# EasyEDA Pro project ProDocument_CPUCable_2023-08-07.epro

# Schematic Schematic4
Create Date: 2023-04-15; Page Name: P1; Project Name: FS2040_NSPW_FN13101; Schematic Name: Schematic4; Update Date: 2023-04-15; Company: 嘉立创EDA; Page Size: A3; Version: V1.0
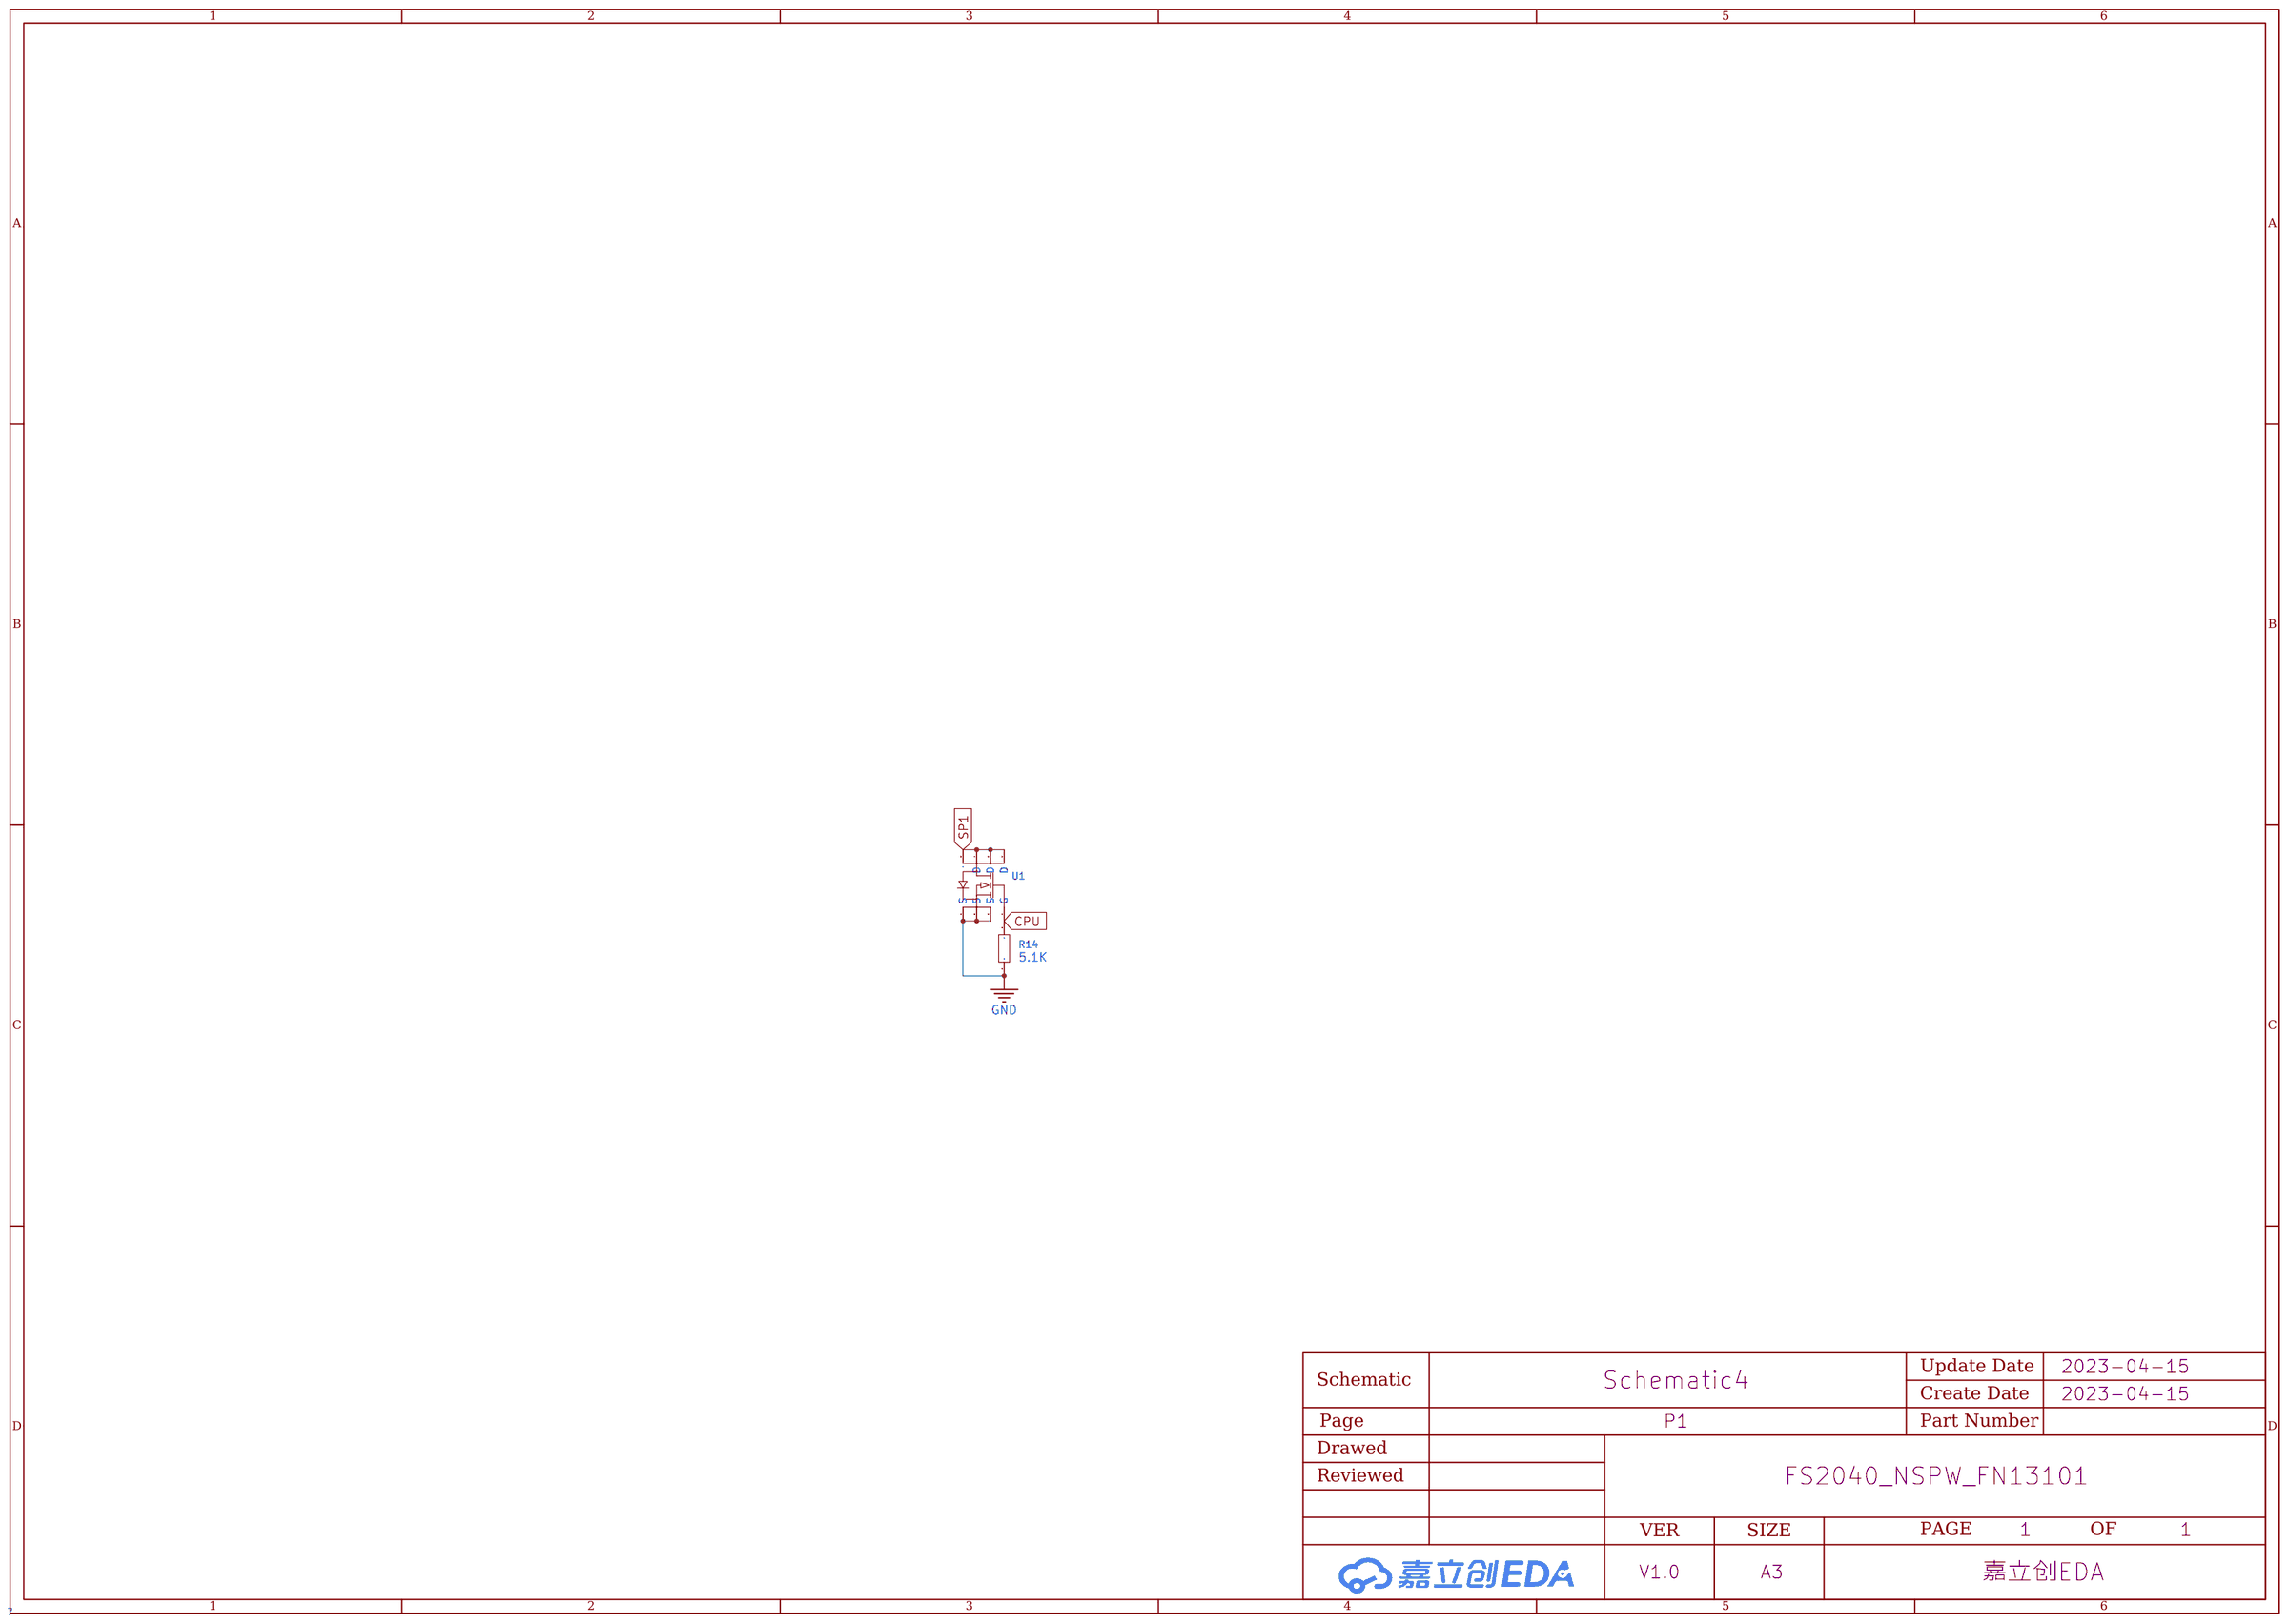
[diagram p0: schematic sheet]

## Parts
R14  5.1K  [R0402_FS]
U1  AP50N03DF  [POWERVDFN-8_L3.2-W3.1-P0.65-LS3.3-BL-1]

## Library data of the parts
R14 = RMC04025.1K1%N: 阻值:5.1kΩ;精度:±1%;功率:62.5mW;; LCSC Part Name: 5.1kΩ ±1% 62.5mW; Supplier Part: C325521; Manufacturer: Tyohm(幸亚电阻); Supplier Footprint: 0402; JLCPCB Part Class: Extended Part; Datasheet: https://atta.szlcsc.com/upload/public/pdf/source/20190115/C325521_1EC5F156994D781C7E2B08432302F19F.pdf; Supplier: LCSC; Tolerance: ±1%; Power(Watts): 62.5mW
U1 = AP50N03DF: 类型:N沟道;漏源电压(Vdss):30V;连续漏极电流(Id):50A;功率(Pd):26W;导通电阻(RDS(on)@Vgs,Id):10.5mΩ@10V,6A;阈值电压(Vgs(th)@Id):1.6V@250uA;栅极电荷(Qg@Vgs):4.2nC@4.5V;输入电容(Ciss@Vds):870pF@15V;反向传输电容(Crss@Vds):87pF@15V;工作温度:-55℃~+150℃@(Tj);; LCSC Part Name: N沟道 30V 50A; Supplier Part: C3011272; Manufacturer: APM(永源微电子); Supplier Footprint: PDFN-8L(3x3); JLCPCB Part Class: Extended Part; Datasheet: https://atta.szlcsc.com/upload/public/pdf/source/20220513/E6E6E07767A418CFE2CF54FF8E524C5B.pdf; Supplier: LCSC; Type: N沟道; Drain Source Voltage (Vdss): 30V; Continuous Drain Current (Id): 50A; Power Dissipation (Pd): 26W; Drain Source On Resistance (RDS(on)@Vgs,Id): 10.5mΩ@10V,6A; Gate Threshold Voltage (Vgs(th)@Id): 1.6V@250uA; Total Gate Charge (Qg@Vgs): 4.2nC@4.5V; Input Capacitance (Ciss@Vds): 870pF@15V; Reverse Transfer Capacitance (Crss@Vds): 87pF@15V; Operating Temperature: -55℃~+150℃@(Tj)

## Nets
GND: R14.1 U1.1(S) U1.2(S) U1.3(S)
CPU: R14.2 U1.4(G)
SP1: U1.5(D) U1.6(D) U1.7(D) U1.8(D)

# Board PCB6_2
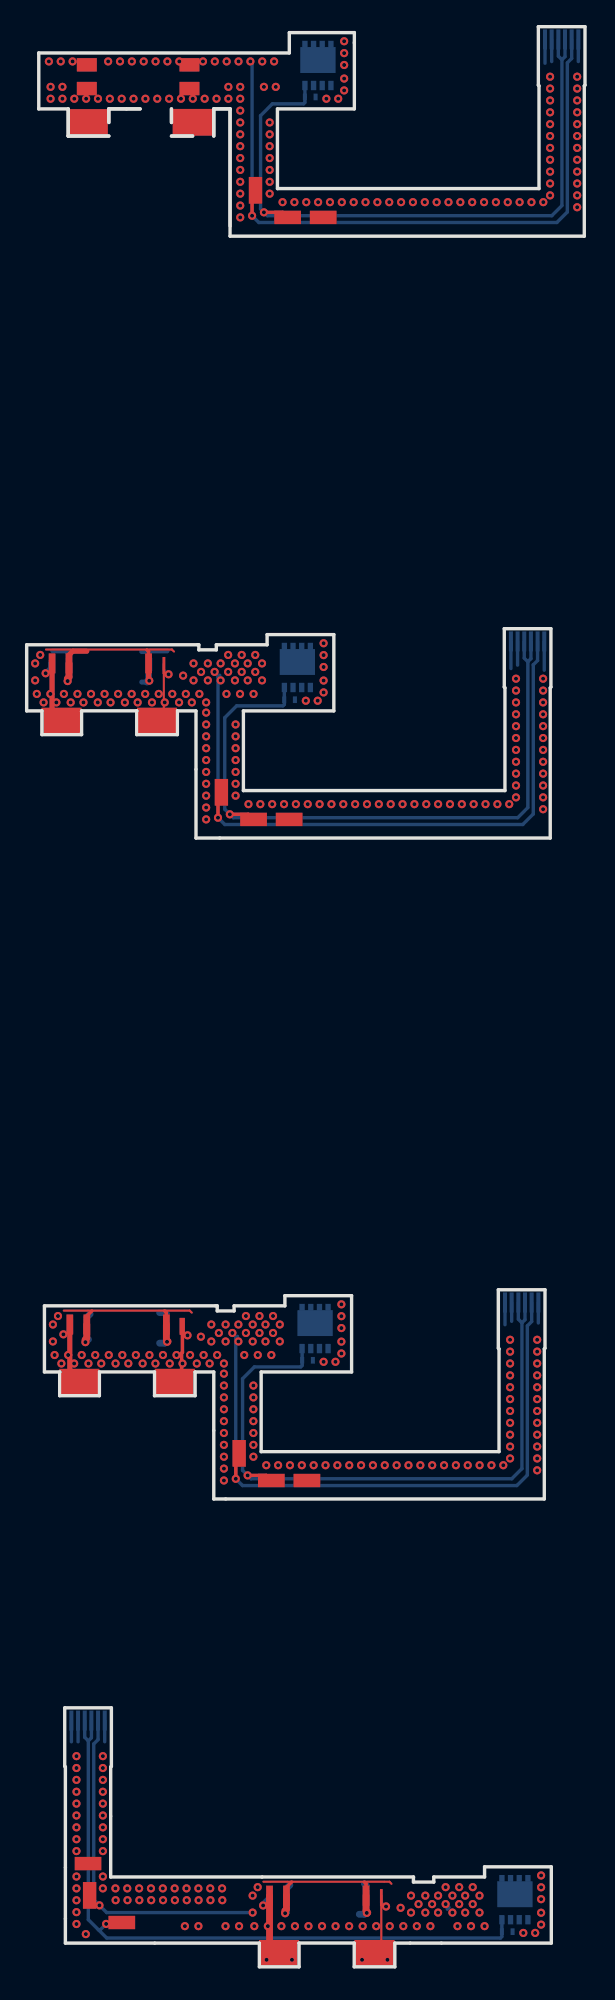
[diagram p1: board, top side]
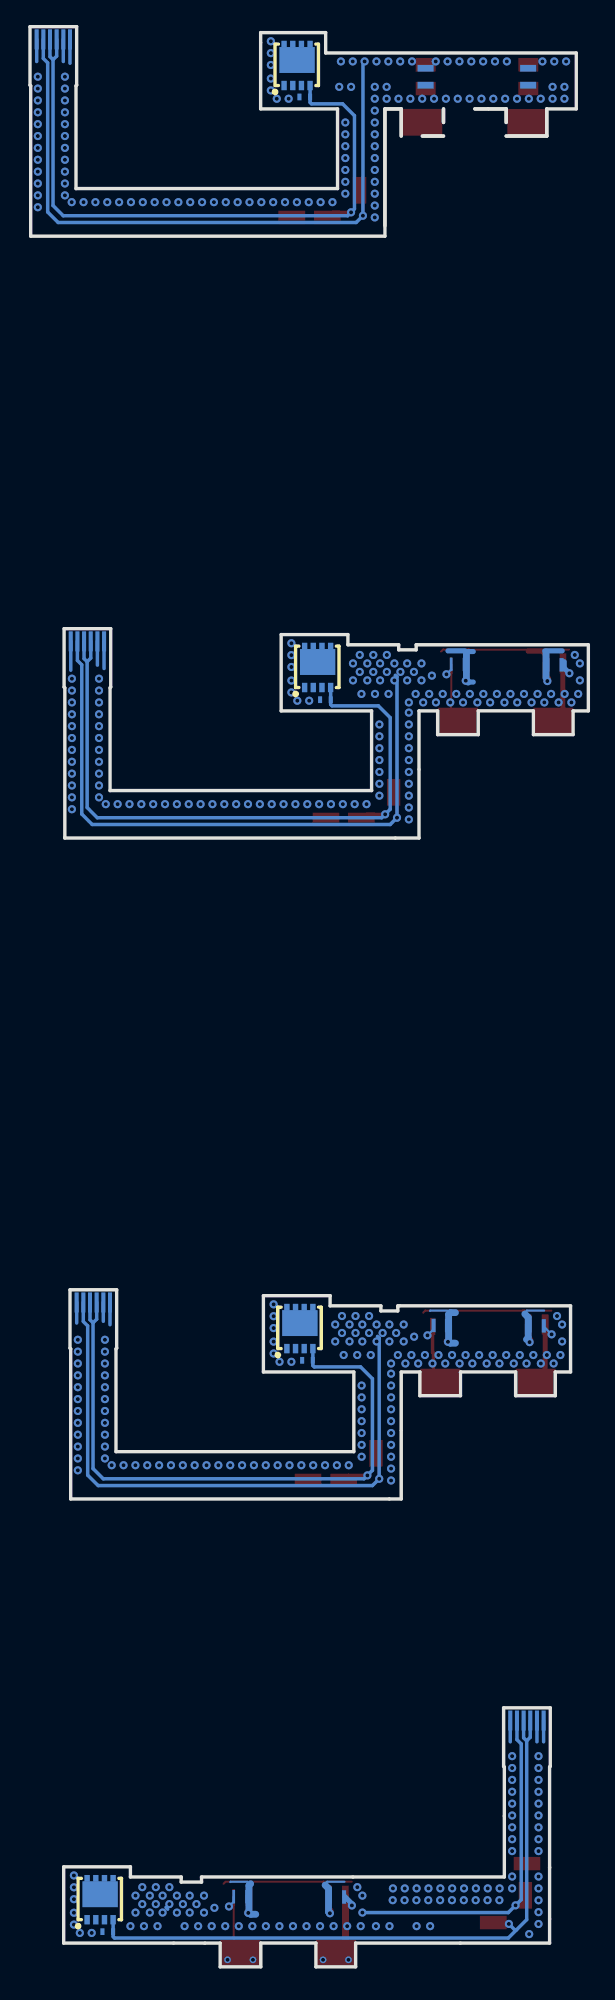
[diagram p2: board, bottom side, seen from below]

Outline 41.88 x 145.32 mm; copper layers: Top Layer, Bottom Layer. Coordinates in mm from the lower left corner of the outline.
Outline path: 3.11,139.17 0.91,139.17 0.91,143.36 19.7,143.36 19.7,144.88 24.58,144.88 24.58,139.17 18.81,139.17 18.81,133.2 38.43,133.2 38.43,140.9 38.38,140.95 38.38,145.32 41.88,145.32 41.88,140.95 41.82,140.89 41.82,129.63 15.26,129.63 15.26,139.17 ; 3.11,139.17 3.11,137.13 ; 3.11,139.17 3.11,137.13 ; 3.11,137.13 6.16,137.13 3.11,137.13 ; 6.16,139.17 6.16,138.15 6.16,139.17 ; 6.16,139.17 8.51,139.17 6.16,139.17 ; 14.04,139.17 14.04,137.13 14.04,139.17 ; 14.04,139.17 15.26,139.17 ; 14.04,139.17 15.26,139.17 ; 15.26,139.17 15.26,130.4 ; 0,99.03 0,94.08 1.14,94.08 1.14,92.3 4.12,92.3 4.12,94.08 8.25,94.08 8.25,92.3 11.3,92.3 11.3,94.08 12.7,94.08 12.7,84.55 39.27,84.55 39.27,95.8 39.32,95.85 39.32,100.23 35.82,100.23 35.82,95.86 35.87,95.81 35.87,88.11 16.26,88.11 16.26,94.08 23.04,94.08 23.04,99.79 18.03,99.79 18.03,99.03 14.22,99.03 14.22,98.65 12.91,98.65 12.91,99.03 0,99.03 ; 1.33,49.51 1.33,44.56 2.48,44.56 2.48,42.78 5.45,42.78 5.45,44.56 9.59,44.56 9.59,42.78 12.64,42.78 12.64,44.56 14.03,44.56 14.03,35.05 38.82,35.05 38.82,46.28 38.88,46.34 38.88,50.72 35.38,50.72 35.38,46.34 35.43,46.29 35.43,38.59 17.59,38.59 17.59,44.56 24.37,44.56 24.37,50.27 19.37,50.27 19.37,49.51 15.56,49.51 15.56,49.13 14.29,49.13 14.29,49.51 1.33,49.51 ; 2.85,19.4 6.35,19.4 6.35,15.02 6.3,14.97 6.3,6.73 29.01,6.73 29.01,6.35 30.54,6.35 30.54,6.73 34.35,6.73 34.35,7.49 39.35,7.49 39.35,1.78 27.62,1.78 27.62,0 24.57,0 24.57,1.78 20.43,1.78 20.43,0 17.46,0 17.46,1.78 2.91,1.78 2.91,14.97 2.85,15.02 2.85,19.4 ; 10.86,139.17 10.86,138.15 10.86,139.17 ; 10.86,137.13 12.45,137.13 10.86,137.13
Stack: Top Layer 0.035mm / Dielectric1 0.025mm PI er 3.3 / Bottom Layer 0.035mm

## Design rules (mm)
template: 用户自定义配置
spacing safeClearance (default): track to track 0.152, other pairs 0 to 0.152
track width trackWidth (default): min 0.127, default 0.254, max 2.54
differential pair differentialPair (default): width min 0.127, default 0.254, max 2.54; gap min 0.152, default 0.152
via viaSize (default): diameter min 0.5, default 0.61, max 10; hole min 0.3, default 0.305, max 5.999

## Placement (name value [footprint] x y rotation side)
NOREF  -  [Pad_e165]  41.38 144.37 0 top
NOREF#2  -  [Pad_e341]  22.24 131.04 90 top
NOREF#3  -  [Pad_e644]  4.51 140.69 0 top
NOREF#4  -  [Pad_e157]  39.88 144.37 0 top
NOREF#5  -  [Pad_e158]  40.38 144.37 0 top
NOREF#6  -  [Pad_e96]  2.62 93.31 0 top
NOREF#7  -  [Pad_e247]  25.46 5.33 90 top
NOREF#8  -  [Pad_e3117]  4.41 48.01 270 top
NOREF#9  -  [Pad_e598]  12.21 142.47 0 top
NOREF#10  -  [Pad_e167]  40.88 144.37 0 top
NOREF#11  -  [Pad_e2862]  36.38 49.76 0 top
NOREF#12  -  [Pad_e3034]  11.11 43.8 0 top
NOREF#13  -  [Pad_e297]  26.09 1.02 0 top
NOREF#14  -  [Pad_e97]  10.3 97.48 90 top
NOREF#15  -  [Pad_e92]  2.01 97.53 270 top
NOREF#16  -  [Pad_e1716]  37.82 99.28 0 top
NOREF#17  -  [Pad_e3133]  11.61 48.04 90 top
NOREF#18  -  [Pad_e272]  18.22 5.33 270 top
NOREF#19  -  [Pad_e489]  7.13 3.32 90 top
NOREF#20  -  [Pad_e592]  4.51 142.21 0 top
NOREF#21  -  [Pad_e2852]  37.38 49.76 0 top
NOREF#22  -  [Pad_e1673]  37.32 99.28 0 top
NOREF#23  -  [Pad_e3112]  10.6 48.04 90 top
NOREF#24  -  [Pad_e150]  38.88 144.37 0 top
NOREF#25  -  [Pad_e492]  4.6 7.73 90 top
NOREF#26  -  [Pad_e95]  9.78 93.31 0 top
NOREF#27  -  [Pad_e1717]  38.32 99.28 0 top
NOREF#28  -  [Pad_e270]  26.6 5.19 90 top
NOREF#29  -  [Pad_e148]  4.35 18.45 0 top
NOREF#30  -  [Pad_e2851]  35.88 49.76 0 top
NOREF#31  -  [Pad_e271]  18.32 5.23 270 top
NOREF#32  -  [Pad_e646]  12.21 140.94 0 top
NOREF#33  -  [Pad_e3121]  10.48 48.11 90 top
NOREF#34  -  [Pad_e280]  25.58 5.26 90 top
NOREF#35  -  [Pad_e93]  9.27 97.56 90 top
NOREF#36  -  [Pad_e2858]  37.88 49.76 0 top
NOREF#37  -  [Pad_e273]  19.39 5.23 270 top
NOREF#38  -  [Pad_e1764]  17.02 85.95 90 top
NOREF#39  -  [Pad_e94]  10.29 97.56 90 top
NOREF#40  -  [Pad_e340]  19.57 131.04 90 top
NOREF#41  -  [Pad_e91]  3.07 97.53 270 top
NOREF#42  -  [Pad_e102]  3.18 97.63 270 top
NOREF#43  -  [Pad_e398]  5.35 18.45 0 top
NOREF#44  -  [Pad_e396]  5.85 18.45 0 top
NOREF#45  -  [Pad_e395]  4.85 18.45 0 top
NOREF#46  -  [Pad_e1675]  36.82 99.28 0 top
NOREF#47  -  [Pad_e593]  12.21 142.21 0 top
NOREF#48  -  [Pad_e490]  4.72 5.35 0 top
NOREF#49  -  [Pad_e1707]  14.6 87.98 0 top
NOREF#50  -  [Pad_e3119]  3.24 48.11 270 top
NOREF#51  -  [Pad_e3037]  21.02 36.43 90 top
NOREF#52  -  [Pad_e2861]  36.88 49.76 0 top
NOREF#53  -  [Pad_e276]  19.49 5.33 270 top
NOREF#54  -  [Pad_e1763]  19.69 85.95 90 top
NOREF#55  -  [Pad_e2995]  3.95 43.8 0 top
NOREF#56  -  [Pad_e1719]  38.82 99.28 0 top
NOREF#57  -  [Pad_e278]  26.6 5.26 90 top
NOREF#58  -  [Pad_e3129]  11.67 47.97 90 top
NOREF#59  -  [Pad_e1718]  36.32 99.28 0 top
NOREF#60  -  [Pad_e399]  3.35 18.45 0 top
NOREF#61  -  [Pad_e2849]  38.38 49.76 0 top
NOREF#62  -  [Pad_e2986]  15.94 38.46 0 top
NOREF#63  -  [Pad_e557]  17.16 133.07 0 top
NOREF#64  -  [Pad_e645]  12.21 140.69 0 top
NOREF#65  -  [Pad_e3120]  4.51 48.11 270 top
NOREF#66  -  [Pad_e151]  39.38 144.37 0 top
NOREF#67  -  [Pad_e98]  9.14 97.63 90 top
NOREF#68  -  [Pad_e668]  4.59 138.15 0 top
NOREF#69  -  [Pad_e647]  4.51 140.94 0 top
NOREF#70  -  [Pad_e3063]  18.35 36.43 90 top
NOREF#71  -  [Pad_e238]  18.93 1.02 0 top
NOREF#72  -  [Pad_e3118]  3.34 48.01 270 top
NOREF#73  -  [Pad_e101]  1.91 97.63 270 top
NOREF#74  -  [Pad_e595]  4.51 142.47 0 top
NOREF#75  -  [Pad_e400]  3.85 18.45 0 top
NOREF#76  -  [Pad_e667]  12.45 138.17 0 top
R14  5.1K  [R0402_FS]  19.72 94.91 180 bottom
R14#2  -  [R0402_FS]  21.07 45.43 180 bottom
R14#3  -  [R0402_FS]  21.27 140.06 180 bottom
R14#4  -  [R0402_FS]  36.04 2.64 180 bottom
U1  AP50N03DF  [POWERVDFN-8_L3.2-W3.1-P0.65-LS3.3-BL-1]  20.3 97.38 180 bottom
U1#2  -  [POWERVDFN-8_L3.2-W3.1-P0.65-LS3.3-BL-1]  21.64 47.86 180 bottom
U1#3  -  [POWERVDFN-8_L3.2-W3.1-P0.65-LS3.3-BL-1]  21.84 142.47 180 bottom
U1#4  -  [POWERVDFN-8_L3.2-W3.1-P0.65-LS3.3-BL-1]  36.62 5.08 180 bottom

## Footprints (pads in the part's own frame, mm; a bottom-side part is the same pattern mirrored in y, then rotated)
Pad_e91
  rect 1x0.3 smd far side: 1(0,0)
Pad_e92
  rect 1x0.3 smd far side: 1(0,0)
Pad_e93
  rect 1x0.3 smd far side: 1(0,0)
Pad_e94
  rect 1x0.2 smd far side: 1(0,0)
Pad_e95
  rect 3x2 smd: 1(0,0)
Pad_e96
  rect 3x2 smd: 1(0,0)
Pad_e97
  rect 1.27x0.2 smd: 1(0,0)
Pad_e98
  rect 1.5x0.5 smd: 1(0,0)
Pad_e101
  rect 1.5x0.5 smd: 1(0,0)
Pad_e102
  rect 1.5x0.5 smd: 1(0,0)
Pad_e148
  rect 0.3x1.5 smd far side: 1(0,0)
Pad_e150
  rect 0.3x1.5 smd far side: 1(0,0)
Pad_e151
  rect 0.3x1.5 smd far side: 1(0,0)
Pad_e157
  rect 0.3x1.5 smd far side: 1(0,0)
Pad_e158
  rect 0.3x1.5 smd far side: 1(0,0)
Pad_e165
  rect 0.3x1.5 smd far side: 1(0,0)
Pad_e167
  rect 0.3x1.5 smd far side: 1(0,0)
Pad_e238
  rect 3x2 smd: 1(0,0)
Pad_e247
  rect 1.5x0.5 smd: 1(0,0)
Pad_e270
  rect 1.27x0.2 smd: 1(0,0)
Pad_e271
  rect 1x0.3 smd far side: 1(0,0)
Pad_e272
  rect 1.5x0.5 smd: 1(0,0)
Pad_e273
  rect 1x0.3 smd far side: 1(0,0)
Pad_e276
  rect 1.5x0.5 smd: 1(0,0)
Pad_e278
  rect 1x0.2 smd far side: 1(0,0)
Pad_e280
  rect 1x0.3 smd far side: 1(0,0)
Pad_e297
  rect 3x2 smd: 1(0,0)
Pad_e340
  rect 1x2 smd: 1(0,0)
Pad_e341
  rect 1x2 smd: 1(0,0)
Pad_e395
  rect 0.3x1.5 smd far side: 1(0,0)
Pad_e396
  rect 0.3x1.5 smd far side: 1(0,0)
Pad_e398
  rect 0.3x1.5 smd far side: 1(0,0)
Pad_e399
  rect 0.3x1.5 smd far side: 1(0,0)
Pad_e400
  rect 0.3x1.5 smd far side: 1(0,0)
Pad_e489
  rect 1x2 smd: 1(0,0)
Pad_e490
  rect 1x2 smd: 1(0,0)
Pad_e492
  rect 1x2 smd: 1(0,0)
Pad_e557
  rect 1x2 smd: 1(0,0)
Pad_e592
  rect 1.2x0.5 smd far side: 1(0,0)
Pad_e593
  rect 1.2x0.5 smd far side: 1(0,0)
Pad_e595
  rect 1.5x1 smd: 1(0,0)
Pad_e598
  rect 1.5x1 smd: 1(0,0)
Pad_e644
  rect 1.5x1 smd: 1(0,0)
Pad_e645
  rect 1.5x1 smd: 1(0,0)
Pad_e646
  rect 1.2x0.5 smd far side: 1(0,0)
Pad_e647
  rect 1.2x0.5 smd far side: 1(0,0)
Pad_e667
  rect 3x2 smd: 1(0,0)
Pad_e668
  rect 3x2 smd: 1(0,0)
Pad_e1673
  rect 0.3x1.5 smd far side: 1(0,0)
Pad_e1675
  rect 0.3x1.5 smd far side: 1(0,0)
Pad_e1707
  rect 1x2 smd: 1(0,0)
Pad_e1716
  rect 0.3x1.5 smd far side: 1(0,0)
Pad_e1717
  rect 0.3x1.5 smd far side: 1(0,0)
Pad_e1718
  rect 0.3x1.5 smd far side: 1(0,0)
Pad_e1719
  rect 0.3x1.5 smd far side: 1(0,0)
Pad_e1763
  rect 1x2 smd: 1(0,0)
Pad_e1764
  rect 1x2 smd: 1(0,0)
Pad_e2849
  rect 0.3x1.5 smd far side: 1(0,0)
Pad_e2851
  rect 0.3x1.5 smd far side: 1(0,0)
Pad_e2852
  rect 0.3x1.5 smd far side: 1(0,0)
Pad_e2858
  rect 0.3x1.5 smd far side: 1(0,0)
Pad_e2861
  rect 0.3x1.5 smd far side: 1(0,0)
Pad_e2862
  rect 0.3x1.5 smd far side: 1(0,0)
Pad_e2986
  rect 1x2 smd: 1(0,0)
Pad_e2995
  rect 3x2 smd: 1(0,0)
Pad_e3034
  rect 3x2 smd: 1(0,0)
Pad_e3037
  rect 1x2 smd: 1(0,0)
Pad_e3063
  rect 1x2 smd: 1(0,0)
Pad_e3112
  rect 1x0.3 smd far side: 1(0,0)
Pad_e3117
  rect 1x0.3 smd far side: 1(0,0)
Pad_e3118
  rect 1x0.3 smd far side: 1(0,0)
Pad_e3119
  rect 1.5x0.5 smd: 1(0,0)
Pad_e3120
  rect 1.5x0.5 smd: 1(0,0)
Pad_e3121
  rect 1.5x0.5 smd: 1(0,0)
Pad_e3129
  rect 1.27x0.4 smd: 1(0,0)
Pad_e3133
  rect 1x0.3 smd far side: 1(0,0)
POWERVDFN-8_L3.2-W3.1-P0.65-LS3.3-BL-1
  rect 0.4x0.7 smd: 1(-0.975,-1.55) 2(-0.325,-1.55) 3(0.325,-1.55) 4(0.975,-1.55)
  rect 0.4x0.5 smd: 5(0.975,1.55) 6(0.325,1.55) 7(-0.325,1.55) 8(-0.975,1.55)
  rect 2.65x1.94 smd: 8(0,0.36)
R0402_FS
  rect 0.3x0.5 smd: 1(-0.4,0) 2(0.4,0)

## Nets
GND: NOREF.1 NOREF#2.1 NOREF#3.1 NOREF#6.1 NOREF#11.1 NOREF#12.1 NOREF#13.1 NOREF#14.1 NOREF#15.1 NOREF#17.1 NOREF#18.1 NOREF#24.1 NOREF#25.1 NOREF#26.1 NOREF#28.1 NOREF#30.1 NOREF#31.1 NOREF#32.1 NOREF#39.1 NOREF#44.1 NOREF#46.1 NOREF#50.1 NOREF#51.1 NOREF#54.1 NOREF#55.1 NOREF#56.1 NOREF#57.1 NOREF#58.1 NOREF#59.1 NOREF#60.1 NOREF#61.1 NOREF#64.1 NOREF#66.1 NOREF#68.1 NOREF#69.1 NOREF#71.1 NOREF#72.1 NOREF#73.1 NOREF#75.1 NOREF#76.1 R14.1 R14#2.1 R14#3.1 R14#4.1 U1.1 U1.2 U1.3 U1#2.1 U1#2.2 U1#2.3 U1#3.1 U1#3.2 U1#3.3 U1#4.1 U1#4.2 U1#4.3
CPU: NOREF#4.1 NOREF#5.1 NOREF#16.1 NOREF#19.1 NOREF#21.1 NOREF#22.1 NOREF#29.1 NOREF#38.1 NOREF#40.1 NOREF#45.1 NOREF#52.1 NOREF#70.1 R14.2 R14#2.2 R14#3.2 R14#4.2 U1.4 U1#2.4 U1#3.4 U1#4.4
SP1: NOREF#7.1 NOREF#8.1 NOREF#9.1 NOREF#10.1 NOREF#20.1 NOREF#23.1 NOREF#27.1 NOREF#33.1 NOREF#34.1 NOREF#35.1 NOREF#36.1 NOREF#37.1 NOREF#41.1 NOREF#42.1 NOREF#43.1 NOREF#47.1 NOREF#48.1 NOREF#49.1 NOREF#53.1 NOREF#62.1 NOREF#63.1 NOREF#65.1 NOREF#67.1 NOREF#74.1 U1.5 U1.6 U1.7 U1.8 U1#2.5 U1#2.6 U1#2.7 U1#2.8 U1#3.5 U1#3.6 U1#3.7 U1#3.8 U1#4.5 U1#4.6 U1#4.7 U1#4.8

## Via types
v1: diameter 0.61, hole 0.305, Top Layer to Bottom Layer, 472 vias
v2: diameter 0.5, hole 0.299, Top Layer to Bottom Layer, 4 vias

## Routing (per net, layer and track width the routed paths; a pad name or vN(x,y) marks a point on that pad's centre or on a via; arc(x,y) is an arc through that point)
GND: length 53.3
  Top Layer w0.152: 10.29,97.63 10.29,93.82 NOREF#26.1 ; 26.6,5.33 26.6,1.52 NOREF#13.1
  Top Layer w0.254: 11.68,48.12 11.68,46.03 11.62,45.97 11.62,44.3 NOREF#12.1
  Top Layer w0.381: NOREF#73.1 1.91,94.02 NOREF#6.1 ; NOREF#55.1 3.24,44.51 NOREF#50.1
  Top Layer w0.508: NOREF#71.1 18.22,1.73 NOREF#18.1
  Bottom Layer w0.152: v1(26.96,4.52) 26.6,4.88 NOREF#57.1 ; v1(12.06,47.3) 11.62,47.75 11.62,48.04 ; v1(2.76,47.38) 3.34,47.96 NOREF#72.1 ; NOREF#39.1 10.29,97.17 v1(10.64,96.82)
  Bottom Layer w0.254: NOREF#75.1 3.85,16.86 ; NOREF#24.1 38.88,142.59 ; NOREF#66.1 39.38,142.72 ; NOREF#44.1 5.85,16.86 ; NOREF.1 41.38,142.72 ; NOREF#61.1 38.38,48.23 ; NOREF#56.1 38.82,97.12 ; NOREF#60.1 3.35,16.86 ; NOREF#46.1 36.82,97.5 ; NOREF#59.1 36.32,97.25 ; NOREF#11.1 36.38,48.36 ; NOREF#30.1 35.88,48.1
  Bottom Layer w0.381: v1(17.73,4.6) 17.73,4.72 18.24,5.23 ; 1.81,97.76 1.81,97.29 v1(1.42,96.89)
  vias: v1(0.76,95.35) v1(1.27,94.71) v1(1.79,140.82) v1(1.79,139.93) v1(1.78,95.35) v1(2.1,45.83) v1(2.23,94.71) v1(2.6,45.19) v1(2.68,140.82) v1(2.68,139.93) v1(2.79,95.35) v1(3.11,45.83) v1(3.3,94.71) v1(3.57,139.93) v1(3.56,45.19) v1(3.81,95.35) v1(3.74,15.78) v1(3.74,14.89) v1(3.74,14) v1(3.74,13.11) v1(3.74,12.23) v1(3.74,11.34) v1(3.74,10.45) v1(3.74,9.56) v1(3.74,8.67) v1(3.74,6.76) v1(3.74,5.88) v1(3.74,4.99) v1(3.74,4.1) v1(3.74,3.21) v1(4.13,45.83) v1(4.26,94.71) v1(4.46,139.93) v1(4.44,2.45) v1(4.64,45.19) v1(4.83,95.35) v1(5.14,45.83) v1(5.35,139.93) v1(5.33,94.71) v1(5.59,45.19) v1(5.72,15.78) v1(5.72,14.89) v1(5.72,14) v1(5.72,13.11) v1(5.72,12.23) v1(5.72,11.34) v1(5.72,10.45) v1(5.72,9.56) v1(5.72,8.67) v1(5.72,6.76) v1(5.72,5.88) v1(5.84,95.35) v1(6.16,45.83) v1(6.24,139.93) v1(6.29,94.71) v1(6.67,45.19) v1(6.66,5.88) v1(6.67,4.99) v1(6.86,95.35) v1(7.13,139.93) v1(7.18,45.83) v1(7.37,94.71) v1(7.55,5.88) v1(7.56,4.99) v1(7.63,45.19) v1(7.87,95.35) v1(8.02,139.93) v1(8.19,45.83) v1(8.32,94.71) v1(8.43,5.88) v1(8.45,4.99) v1(8.7,45.19) v1(8.91,139.93) v1(8.89,95.35) v1(9.21,45.83) v1(9.4,94.71) v1(9.32,5.88) v1(9.34,4.99) v1(9.66,45.19) v1(9.79,139.93) v1(9.91,95.35) v1(10.21,5.88) v1(10.22,45.83) v1(10.23,4.99) v1(10.36,94.71) v1(10.68,139.93) v1(10.73,45.19) v1(10.92,95.35) v1(11.1,5.88) v1(11.12,4.99) v1(11.24,45.83) v1(11.43,94.71) v1(11.57,139.93) v1(11.69,45.19) v1(11.87,3.05) v1(11.94,95.35) v1(11.99,5.88) v1(12.01,4.99) v1(12.26,45.83) v1(12.39,94.71) v1(12.46,139.93) v1(12.76,45.19) v1(12.88,5.88) v1(12.9,4.99) v1(12.88,3.05) v1(12.95,95.35) v1(13.27,45.83) v1(13.35,139.93) v1(13.46,94.71) v1(13.46,93.95) v1(13.46,93.06) v1(13.46,92.17) v1(13.46,91.28) v1(13.46,90.39) v1(13.46,89.5) v1(13.46,88.61) v1(13.46,87.73) v1(13.46,86.84) v1(13.46,85.95) v1(13.72,45.19) v1(13.77,5.88) v1(13.78,4.99) v1(14.24,139.93) v1(14.29,45.83) v1(14.66,5.88) v1(14.67,4.99) v1(14.8,45.19) v1(14.8,44.43) v1(14.8,43.54) v1(14.8,42.65) v1(14.8,41.76) v1(14.8,40.87) v1(14.8,39.99) v1(14.8,39.1) v1(14.8,38.21) v1(14.8,37.32) v1(14.8,36.43) v1(14.91,3.05) v1(14.99,95.35) v1(15.13,140.82) v1(15.13,139.93) v1(15.67,93.06) v1(15.67,92.17) v1(15.67,91.28) v1(15.67,90.39) v1(15.67,89.5) v1(15.67,88.61) v1(15.67,87.73) v1(16.02,140.82) v1(16.02,139.93) v1(16.02,139.04) v1(16.02,138.15) v1(16.02,137.26) v1(16.02,136.37) v1(16.02,135.48) v1(16.02,134.59) v1(16.02,133.71) v1(16.02,132.82) v1(16.02,131.93) v1(16.02,131.04) v1(16,95.35) v1(15.93,3.05) v1(16.32,45.83) v1(16.64,87.09) v1(17.02,95.35) v1(17.01,43.54) v1(17.01,42.65) v1(17.01,41.76) v1(17.01,40.87) v1(17.01,39.99) v1(17.01,39.1) v1(17.01,38.21) v1(17.07,3.05) v1(17.34,45.83) v1(17.53,87.09) v1(17.8,140.82) v1(17.97,37.57) v1(18.09,3.05) v1(18.23,138.15) v1(18.23,137.26) v1(18.23,136.37) v1(18.23,135.48) v1(18.23,134.59) v1(18.23,133.71) v1(18.23,132.82) v1(18.41,87.09) v1(18.35,45.83) v1(18.69,140.82) v1(18.86,37.57) v1(19.11,3.05) v1(19.19,132.18) v1(19.3,87.09) v1(19.75,37.57) v1(20.08,132.18) v1(20.19,87.09) v1(20.12,3.05) v1(20.64,37.57) v1(20.97,132.18) v1(20.94,94.84) v1(21.08,87.09) v1(21.14,3.05) v1(21.53,37.57) v1(21.86,132.18) v1(21.83,94.84) v1(21.97,87.09) v1(22.15,3.05) v1(22.27,99.14) v1(22.27,98.25) v1(22.27,97.36) v1(22.27,96.35) v1(22.27,95.46) v1(22.27,45.32) v1(22.42,37.57) v1(22.48,139.93) v1(22.75,132.18) v1(22.86,87.09) v1(23.16,45.32) v1(23.17,3.05) v1(23.3,37.57) v1(23.37,139.93) v1(23.61,49.62) v1(23.61,48.74) v1(23.61,47.85) v1(23.61,46.83) v1(23.61,45.94) v1(23.64,132.18) v1(23.81,144.23) v1(23.81,143.34) v1(23.81,142.46) v1(23.81,141.44) v1(23.81,140.55) v1(23.75,87.09) v1(24.19,37.57) v1(24.19,3.05) v1(24.53,132.18) v1(24.64,87.09) v1(25.08,37.57) v1(25.2,3.05) v1(25.42,132.18) v1(25.53,87.09) v1(25.97,37.57) v1(26.22,3.05) v1(26.31,132.18) v1(26.42,87.09) v1(26.86,37.57) v1(27.19,132.18) v1(27.31,87.09) v1(27.23,3.05) v1(27.75,37.57) v1(28.08,132.18) v1(28.19,87.09) v1(28.25,3.05) v1(28.64,37.57) v1(28.97,132.18) v1(29.08,87.09) v1(29.27,3.05) v1(29.53,37.57) v1(29.86,132.18) v1(29.97,87.09) v1(30.28,3.05) v1(30.42,37.57) v1(30.75,132.18) v1(30.86,87.09) v1(31.31,37.57) v1(31.64,132.18) v1(31.75,87.09) v1(32.19,37.57) v1(32.31,3.05) v1(32.53,132.18) v1(32.64,87.09) v1(33.08,37.57) v1(33.42,132.18) v1(33.33,3.05) v1(33.53,87.09) v1(33.97,37.57) v1(34.31,132.18) v1(34.42,87.09) v1(34.35,3.05) v1(34.86,37.57) v1(35.19,132.18) v1(35.31,87.09) v1(35.75,37.57) v1(36.08,132.18) v1(36.19,87.09) v1(36.26,46.97) v1(36.26,46.08) v1(36.26,45.19) v1(36.26,44.3) v1(36.26,43.41) v1(36.26,42.53) v1(36.26,41.64) v1(36.26,40.75) v1(36.26,39.86) v1(36.26,38.97) v1(36.26,38.08) v1(36.7,96.49) v1(36.7,95.6) v1(36.7,94.71) v1(36.7,93.82) v1(36.7,92.93) v1(36.7,92.04) v1(36.7,91.15) v1(36.7,90.27) v1(36.7,89.38) v1(36.7,88.49) v1(36.7,87.6) v1(36.97,132.18) v1(37.25,2.54) v1(37.86,132.18) v1(38.14,2.54) v1(38.29,46.97) v1(38.29,46.08) v1(38.29,45.19) v1(38.29,44.3) v1(38.29,43.41) v1(38.29,42.53) v1(38.29,41.64) v1(38.29,40.75) v1(38.29,39.86) v1(38.29,38.97) v1(38.29,38.08) v1(38.29,37.19) v1(38.59,6.85) v1(38.59,5.96) v1(38.59,5.07) v1(38.59,4.05) v1(38.59,3.16) v1(38.75,132.18) v1(38.73,96.49) v1(38.73,95.6) v1(38.73,94.71) v1(38.73,93.82) v1(38.73,92.93) v1(38.73,92.04) v1(38.73,91.15) v1(38.73,90.27) v1(38.73,89.38) v1(38.73,88.49) v1(38.73,87.6) v1(38.73,86.71) v1(39.26,141.58) v1(39.26,140.69) v1(39.26,139.8) v1(39.26,138.91) v1(39.26,138.02) v1(39.26,137.13) v1(39.26,136.25) v1(39.26,135.36) v1(39.26,134.47) v1(39.26,133.58) v1(39.26,132.69) v1(41.29,141.58) v1(41.29,140.69) v1(41.29,139.8) v1(41.29,138.91) v1(41.29,138.02) v1(41.29,137.13) v1(41.29,136.25) v1(41.29,135.36) v1(41.29,134.47) v1(41.29,133.58) v1(41.29,132.69) v1(41.29,131.8) v2(17.99,0.53) v2(19.9,0.53) v2(25.16,0.53) v2(27.06,0.53)
CPU: length 204.6
  Top Layer w0.254: NOREF#70.1 17.97,36.81 v1(16.57,36.81) ; NOREF#38.1 16.64,86.33 v1(15.24,86.33) ; v1(17.8,131.42) 19.19,131.42 NOREF#40.1
  Bottom Layer w0.254: 37.59,97.76 37.32,98.03 NOREF#22.1 ; 37.59,97.76 37.82,97.99 NOREF#16.1 ; 37.59,97.76 37.59,86.84 36.83,86.07 15.49,86.07 v1(15.24,86.33) 14.86,86.71 14.86,93.57 15.75,94.46 19.22,94.46 19.33,94.56 U1.4 ; 4.62,16.92 4.62,3.54 5.39,2.77 ; 4.62,16.92 4.35,17.19 NOREF#29.1 ; 4.62,16.92 4.85,17.15 NOREF#45.1 ; U1#4.4 35.64,2.26 35.54,2.16 6,2.16 5.39,2.77 ; 37.15,48.24 37.15,37.32 36.39,36.56 16.83,36.56 v1(16.57,36.81) 16.19,37.19 16.19,44.05 17.08,44.94 20.56,44.94 20.66,45.04 U1#2.4 ; 37.15,48.24 37.38,48.47 NOREF#21.1 ; 37.15,48.24 36.88,48.51 NOREF#52.1 ; 40.15,142.85 40.38,143.08 NOREF#5.1 ; 40.15,142.85 39.88,143.12 NOREF#4.1 ; 40.15,142.85 40.15,131.93 39.39,131.17 18.05,131.17 v1(17.8,131.42) 17.54,131.67 17.54,138.66 18.43,139.55 20.76,139.55 20.87,139.65 R14#3.2 U1#3.4 ; 5.39,2.77 5.52,2.77 v1(5.96,3.21)
SP1: length 213.4
  Top Layer w0.254: v1(16.91,131.17) 16.91,132.82 NOREF#63.1 ; 25.33,6.35 25.46,6.22 NOREF#7.1 ; NOREF#33.1 10.48,49 10.35,49.13 ; v1(15.68,36.56) 15.68,38.21 NOREF#62.1 ; NOREF#65.1 4.51,48.75 4.89,49.13 ; NOREF#53.1 19.49,5.97 19.87,6.35 ; 9.02,98.65 9.14,98.52 NOREF#67.1 ; NOREF#49.1 14.35,87.73 v1(14.35,86.07)
  Top Layer w0.381: 9.27,96.36 9.14,96.49 NOREF#67.1 ; 4.51,98.55 3.45,98.55 3.18,98.27 NOREF#42.1
  Top Layer w0.508: NOREF#65.1 4.51,47.1 4.38,46.97 ; 3.05,96.49 3.18,96.62 NOREF#42.1 ; 25.58,4.06 25.46,4.19 NOREF#7.1 ; NOREF#33.1 10.48,46.97 10.6,46.84 ; NOREF#53.1 19.49,4.32 19.36,4.19
  Bottom Layer w0.152: 11.87,49.13 11.85,49.16 10.58,49.16 ; 18.29,6.38 19.59,6.38 19.61,6.35 ; 3.31,49.16 4.61,49.16 4.64,49.13 ; 26.85,6.35 26.83,6.38 25.56,6.38
  Bottom Layer w0.254: NOREF#43.1 5.35,17.02 5.03,16.7 5.03,5.03 v1(5.46,4.61) 6,4.06 v1(16.95,4.06) ; 31.55,4.32 31.68,4.45 ; NOREF#27.1 38.32,97.85 38,97.53 38,86.35 37.21,85.57 14.86,85.57 v1(14.35,86.07) 14.35,96.62 14.48,96.74 ; 15.81,47.22 15.68,47.1 v1(15.68,36.56) 16.19,36.05 36.77,36.05 37.55,36.84 37.55,48.01 37.88,48.34 NOREF#36.1 ; 3.18,96.64 3.3,96.51 ; 3.18,98.49 3.26,98.57 ; NOREF#10.1 40.88,142.94 40.55,142.62 40.55,131.44 39.77,130.66 17.41,130.66 v1(16.91,131.17) 16.91,142.47
  Bottom Layer w0.381: 9.25,98.57 10.53,98.57 ; 9.02,96.23 8.64,96.23 ; 8.64,98.52 9.02,98.52 9.14,98.39 ; 1.97,98.57 3.26,98.57
  Bottom Layer w0.508: 4.76,48.9 4.51,48.65 4.51,47.12 4.64,47 ; 25.33,6.22 25.46,6.1 25.46,4.06 25.33,3.94 24.95,3.94 ; v1(19.39,4.01) 19.49,4.12 19.49,5.87 19.74,6.12 ; 9.97,46.72 10.35,46.72 10.48,46.84 10.48,48.88 10.35,49 9.97,49 ; 9.14,98.39 9.14,96.36 9.02,96.23 ; 3.18,98.49 3.18,96.64
  vias: v1(0.63,97.63) v1(0.63,96.36) v1(1.02,98.27) v1(1.67,142.72) v1(1.97,48.11) v1(1.97,46.84) v1(2.35,48.75) v1(2.56,142.72) v1(3.07,96.31) v1(3.44,142.72) v1(4.41,46.79) v1(6.11,142.72) v1(7,142.72) v1(7.89,142.72) v1(8.78,142.72) v1(9.19,96.34) v1(9.67,142.72) v1(10.56,142.72) v1(10.53,46.82) v1(11.45,142.72) v1(11.73,96.72) v1(12.52,97.63) v1(12.52,96.36) v1(13.08,97) v1(13.07,47.2) v1(13.22,142.72) v1(13.59,97.63) v1(13.59,96.36) v1(13.85,48.11) v1(13.85,46.84) v1(14.11,142.72) v1(14.1,97) v1(14.41,47.48) v1(14.55,97.63) v1(14.55,96.36) v1(15,142.72) v1(14.92,48.11) v1(14.92,46.84) v1(15.11,98.27) v1(15.11,97) v1(15.43,47.48) v1(15.62,97.63) v1(15.62,96.36) v1(15.89,142.72) v1(15.88,48.11) v1(15.88,46.84) v1(16.13,98.27) v1(16.13,97) v1(16.45,48.75) v1(16.45,47.48) v1(16.58,97.63) v1(16.58,96.36) v1(16.78,142.72) v1(16.95,48.11) v1(16.95,46.84) v1(16.95,5.33) v1(17.15,98.27) v1(17.15,97) v1(17.33,5.97) v1(17.46,48.75) v1(17.46,47.48) v1(17.67,142.72) v1(17.65,97.63) v1(17.65,96.36) v1(17.91,48.11) v1(17.91,46.84) v1(18.48,48.75) v1(18.48,47.48) v1(18.56,142.72) v1(18.99,48.11) v1(18.99,46.84) v1(25.51,4.04) v1(28.05,4.42) v1(28.83,5.33) v1(28.83,4.06) v1(29.39,4.7) v1(29.9,5.33) v1(29.9,4.06) v1(30.41,4.7) v1(30.86,5.33) v1(30.86,4.06) v1(31.43,5.97) v1(31.43,4.7) v1(31.93,5.33) v1(31.93,4.06) v1(32.44,5.97) v1(32.44,4.7) v1(32.89,5.33) v1(32.89,4.06) v1(33.46,5.97) v1(33.46,4.7) v1(33.97,5.33) v1(33.97,4.06)

## Copper pours and planes (outline as drawn; the poured copper is in the pictures)
GND on Top Layer: 12.18,90.9 40.13,90.9 40.13,83.92 12.18,83.92
GND on Top Layer: 34.57,51.57 39.86,51.57 39.86,34.13 34.57,34.13
GND on Top Layer: 2.02,0.98 15.73,0.98 15.68,7.32 6.97,7.33 6.97,20.16 2.02,20.16
GND on Top Layer: 35.02,101.09 40.51,101.09 40.51,84.04 35.02,84.04
GND on Top Layer: 14.78,8.03 39.86,8.03 39.86,-0.41 14.78,-0.41
GND on Top Layer: 0.95,50.64 24.62,50.64 24.62,42.27 0.95,42.27
GND on Top Layer: -0.51,100.43 23.48,100.43 23.48,91.92 -0.51,91.92
GND on Top Layer: 37.57,146.31 42.5,146.31 42.5,129.22 37.57,129.22
GND on Top Layer: 13.65,41.38 39.35,41.38 39.35,34.64 13.65,34.64
GND on Top Layer: 13.6,135.99 42.37,135.99 42.37,129.09 13.6,129.09
GND on Top Layer: 0.4,145.52 25.29,145.52 25.29,134.98 0.4,134.98
GND on Bottom Layer: 34.74,48.81 39.43,48.81 39.43,40.87 34.74,40.87
GND on Bottom Layer: 0.7,50.9 24.75,50.9 24.75,42.02 0.7,42.02
GND on Bottom Layer: 0.91,145 25.76,145 25.76,136.75 0.91,136.75
GND on Bottom Layer: 35.19,98.33 39.88,98.33 39.88,90.39 35.19,90.39
GND on Bottom Layer: 14.62,137.26 42.5,137.26 42.5,129.22 14.62,129.22
GND on Bottom Layer: 37.74,143.42 42.43,143.42 42.43,135.61 37.74,135.61
GND on Bottom Layer: 2.27,1.24 15.99,1.24 15.99,7.21 6.81,7.21 6.81,17.24 2.27,17.24
GND on Bottom Layer: 12.18,92.17 39.75,92.17 39.75,84.04 12.18,84.04
GND on Bottom Layer: -0.76,100.17 23.99,100.17 23.99,91.66 -0.76,91.66
GND on Bottom Layer: 13.4,42.65 39.35,42.65 39.35,34.39 13.4,34.39
GND on Bottom Layer: 14.15,7.84 39.86,7.84 39.86,-0.38 14.15,-0.38
SP1 on Top Layer: 15.72,7.85 34.44,7.85 34.44,3.71 15.72,3.71
SP1 on Top Layer: 0.74,50.63 19.46,50.63 19.46,46.49 0.74,46.49
SP1 on Top Layer: 0.89,143.37 19.61,143.37 19.61,142.02 0.89,142.02
SP1 on Top Layer: -0.6,99.77 18.12,99.77 18.12,96 -0.6,96
SP1 on Bottom Layer: 15.68,7.57 37.96,7.57 37.96,3.68 15.68,3.68
SP1 on Bottom Layer: -0.63,99.87 21.64,99.87 21.64,95.98 -0.63,95.98
SP1 on Bottom Layer: 0.91,145.02 23.18,145.02 23.18,142.02 0.91,142.02
SP1 on Bottom Layer: 0.7,50.35 22.98,50.35 22.98,46.46 0.7,46.46

## Text on the board
Document Layer: 0.2mm | Total thickness at gold finger 0.3mm (FPC+PI) | 金手指处按总厚度0.3mm制作 | FPC厚度0.2mm | 0.3mm
